# Altium project PCB_Project.PrjPcb
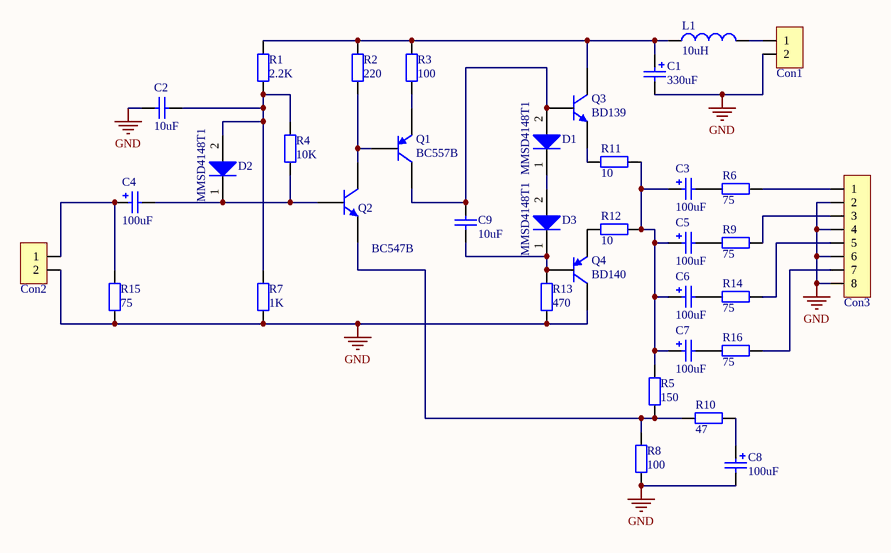
[diagram p0: Sheet1.SchDoc]
1 sheet, 36 parts. Net scope: global (net labels, ports and power ports of the same name join across sheets).
Board file: Video.PcbDoc

## Sheet Sheet1.SchDoc
size A4; SheetNumber: 1; SheetTotal: 1; SPICEModelCacheEDUVJKNU: <root> / <DocumentId>EDUVJKNU</DocumentId> / <CacheFrame Number="0"> / <Model Name="qbc547b" Kind="MDL"> / <Text>* / .MODEL QBC547B NPN( / +     IS=2.39E-14 / +     NF=1.008 / +     ISE=3.545E-15 / +     NE=1.541 / +     BF=294.3 / +     IKF=0.1357 / +     VAF=63.2 / +     NR=1.004 / +     ISC=6.272E-14 / +     NC=1.243 / +     BR=7.946 / +     IKR=0.1144 / +     VAR=25.9 / +     RB=1 / +     IRB=1E-06 / +     RBM=1 / +     RE=0.4683 / +     RC=0.85 / +     XTB=0 / +     EG=1.11 / +     XTI=3 / +     CJE=1.358E-11 / +     VJE=0.65 / +     MJE=0.3279 / +     TF=4.391E-10 / +     XTF=120 / +     VTF=2.643 / +     ITF=0.7495 / +     PTF=0 / +     CJC=3.728E-12 / +     VJC=0.3997 / +     MJC=0.2955 / +     XCJC=0.6193 / +     TR=1E-32 / +     CJS=0 / +     VJS=0.75 / +     MJS=0.333 / +     FC=0.9579 )</Text> / </Model> / <Model Name="qbc557b" Kind="MDL"> / <Text>* / .MODEL QBC557B PNP( / +     IS=3.834E-14 / +     NF=1.008 / +     ISE=1.219E-14 / +     NE=1.528 / +     BF=344.4 / +     IKF=0.08039 / +     VAF=21.11 / +     NR=1.005 / +     ISC=2.852E-13 / +     NC=1.28 / +     BR=14.84 / +     IKR=0.047 / +     VAR=32.02 / +     RB=1 / +     IRB=1E-06 / +     RBM=1 / +     RE=0.6202 / +     RC=0.5713 / +     XTB=0 / +     EG=1.11 / +     XTI=3 / +     CJE=1.23E-11 / +     VJE=0.6106 / +     MJE=0.378 / +     TF=5.595E-10 / +     XTF=3.414 / +     VTF=5.23 / +     ITF=0.1483 / +     PTF=0 / +     CJC=1.084E-11 / +     VJC=0.1022 / +     MJC=0.3563 / +     XCJC=0.6288 / +     TR=1E-32 / +     CJS=0 / +     VJS=0.75 / +     MJS=0.333 / +     FC=0.8027 )</Text> / </Model> / </CacheFrame> / </root>

### Parts
C1  value 330uF  [CAP Elect 8X4]  (hidden comment: Cap Pol1)
C2  value 10uF  [H0805]  (hidden comment: Cap)
C3  value 100uF  [CAP Elect 5X2.5]  (hidden comment: Cap Pol1)
C4  value 100uF  [CAP Elect 5X2.5]  (hidden comment: Cap Pol1)
C5  value 100uF  [CAP Elect 5X2.5]  (hidden comment: Cap Pol1)
C6  value 100uF  [CAP Elect 5X2.5]  (hidden comment: Cap Pol1)
C7  value 100uF  [CAP Elect 5X2.5]  (hidden comment: Cap Pol1)
C8  value 100uF  [CAP Elect 5X2.5]  (hidden comment: Cap Pol1)
C9  value 10uF  [H0805]  (hidden comment: Cap)
Con1  XH-2A  [XH-2A]  (value not drawn)
Con2  XH-2A  [XH-2A]  (value not drawn)
Con3  XH-8A  [XH-8A]  (value not drawn)
D1  MMSD4148T1  [ONSC-SOD-123-2-425-04_V]
D2  MMSD4148T1  [ONSC-SOD-123-2-425-04_V]
D3  MMSD4148T1  [ONSC-SOD-123-2-425-04_V]
L1  value 10uH  [INDP7870X53N]  (hidden comment: Inductor)
Q1  BC557B  [SOT54]
Q2  BC547B  [SOT54]
Q3  BD139  [TO-126]
Q4  BD140  [TO-126]
R1  value 2.2K  [H0805]  (hidden comment: Res2)
R2  value 220  [H0805]  (hidden comment: Res2)
R3  value 100  [H0805]  (hidden comment: Res2)
R4  value 10K  [H0805]  (hidden comment: Res2)
R5  value 150  [H0805]  (hidden comment: Res2)
R6  value 75  [H0805]  (hidden comment: Res2)
R7  value 1K  [H0805]  (hidden comment: Res2)
R8  value 100  [H0805]  (hidden comment: Res2)
R9  value 75  [H0805]  (hidden comment: Res2)
R10  value 47  [H0805]  (hidden comment: Res2)
R11  value 10  [H1206]  (hidden comment: Res2)
R12  value 10  [H1206]  (hidden comment: Res2)
R13  value 470  [H0805]  (hidden comment: Res2)
R14  value 75  [H0805]  (hidden comment: Res2)
R15  value 75  [H0805]  (hidden comment: Res2)
R16  value 75  [H0805]  (hidden comment: Res2)

### Nets
GND: C1.2 C2.2 C8.2 Con1.2 Con2.2 Con3.2 Con3.4 Con3.6 Con3.8 Q4.2(C) R7.1 R8.1 R13.1 R15.1
NetC1_1: C1.1 L1.1 Q3.2(C) R1.2 R2.2 R3.2
NetC2_1: C2.1 D2.2(A) R1.1 R4.2 R7.2
NetC3_1: C3.1 C5.1 C6.1 C7.1 R5.2 R11.1 R12.1
NetC3_2: C3.2 R6.2
NetC4_1: C4.1 Con2.1 R15.2
NetC4_2: C4.2 D2.1(K) Q2.2(B) R4.1
NetC5_2: C5.2 R9.2
NetC6_2: C6.2 R14.2
NetC7_2: C7.2 R16.2
NetC8_1: C8.1 R10.1
NetC9_1: C9.1 D3.1(K) Q4.3(B) R13.2
NetC9_2: C9.2 D1.2(A) Q1.3(C) Q3.3(B)
NetCon1_1: Con1.1 L1.2
NetCon3_1: Con3.1 R6.1
NetCon3_3: Con3.3 R9.1
NetCon3_5: Con3.5 R14.1
NetCon3_7: Con3.7 R16.1
NetD1_1: D1.1(K) D3.2(A)
NetQ1_1: Q1.1(E) R3.1
NetQ1_2: Q1.2(B) Q2.3(C) R2.1
NetQ2_1: Q2.1(E) R5.1 R8.2 R10.2
NetQ3_1: Q3.1(E) R11.2
NetQ4_1: Q4.1(E) R12.2

### Library data of the parts
C1 C3-C8 = Cap Pol1: Polarized Capacitor (Radial)
C2 C9 = Cap: Capacitor
Con1 Con2 = XH-2A: 2.5mm
Con3 = XH-8A: 2.5mm
D1-D3 = MMSD4148T1: Switching Diode, 2-Pin SOD-123, Tape and Reel; Manufacturer: On Semiconductor; Configuration: Single; IF Max (A): 0.2; trr Max (ns): 4; DatasheetVersion: Rev. 11; PackageVersion: Rev. G, 10/2009; PackageReference: SOD-123-2-425-04; PackageDescription: 2-Pin SOD, Body 1.6 x 2.69 mm; Supplier 1: Digi-Key; Supplier Part Number 1: MMSD4148T1OSCT-ND; Packing: Tape and Reel; RoHS: FALSE; Mounting Technology: Surface Mount; PartNumber: MMSD4148T1; ComponentLink1Description: Manufacturer URL; ComponentLink1URL: http://www.onsemi.com/; ComponentLink2Description: Datasheet; ComponentLink2URL: http://www.onsemi.com/pub_link/Collateral/MMSD4148T1-D.PDF; ComponentLink3Description: Package Specification; ComponentLink3URL: http://www.onsemi.com/pub_link/Collateral/425-04.PDF
L1 = Inductor: Code_IEC: 1005; Published: 8-Jun-2000; LatestRevisionDate: 29-May-2009; LatestRevisionNote: IPC-7351 Footprint Added.; PackageReference: 0402-A; Publisher: Altium Limited; PackageDescription: Chip Inductor; Code_JEITA: 0402
Q1 = BC557B: PNP General-purpose Transistor; Published: 17-Sep-2003; LatestRevisionDate: 12-Dec-2006; LatestRevisionNote: Footprint pad sequence fixed.; DatasheetVersion: 15-Apr-1999; PackageVersion: Feb-1997; PackageReference: SOT54; Publisher: Altium Limited; PackageDescription: Plastic Single-Ended Leaded (through hole) package; 3 Leads (TO-92); Code_JEITA: SC-43; Code_JEDEC: TO-92; ComponentLink1Description: Manufacturer Link; ComponentLink1URL: http://www.semiconductors.philips.com/; ComponentLink2Description: Datasheet; ComponentLink2URL: http://www.semiconductors.philips.com/acrobat/datasheets/BC556_557_3.pdf
Q2 = BC547B: NPN General-purpose Transistor; Published: 17-Sep-2003; LatestRevisionDate: 12-Dec-2006; LatestRevisionNote: Footprint pad sequence fixed.; DatasheetVersion: 15-Apr-1999; PackageVersion: Feb-1997; PackageReference: SOT54; Publisher: Altium Limited; PackageDescription: Plastic Single-Ended Leaded (through hole) package; 3 Leads (TO-92); Code_JEITA: SC-43; Code_JEDEC: TO-92; ComponentLink1Description: Manufacturer Link; ComponentLink1URL: http://www.semiconductors.philips.com/; ComponentLink2Description: Datasheet; ComponentLink2URL: http://www.semiconductors.philips.com/acrobat/datasheets/BC546_547_3.pdf
Q3 = BD139: NPN SILICON TRANSISTORS
Q4 = BD140: PNP SILICON TRANSISTORS
R1-R16 = Res2: Resistor; Published: 8-Jun-2000; LatestRevisionDate: 17-Jul-2002; LatestRevisionNote: Re-released for DXP Platform.; PackageReference: AXIAL-0.4; Publisher: Altium Limited; PackageDescription: Axial Device, Thru-Hole; 2 Leads; 0.4 in Pin Spacing